# EAGLE design YUSynth-LFO-ioboard (EAGLE 9.6.2)
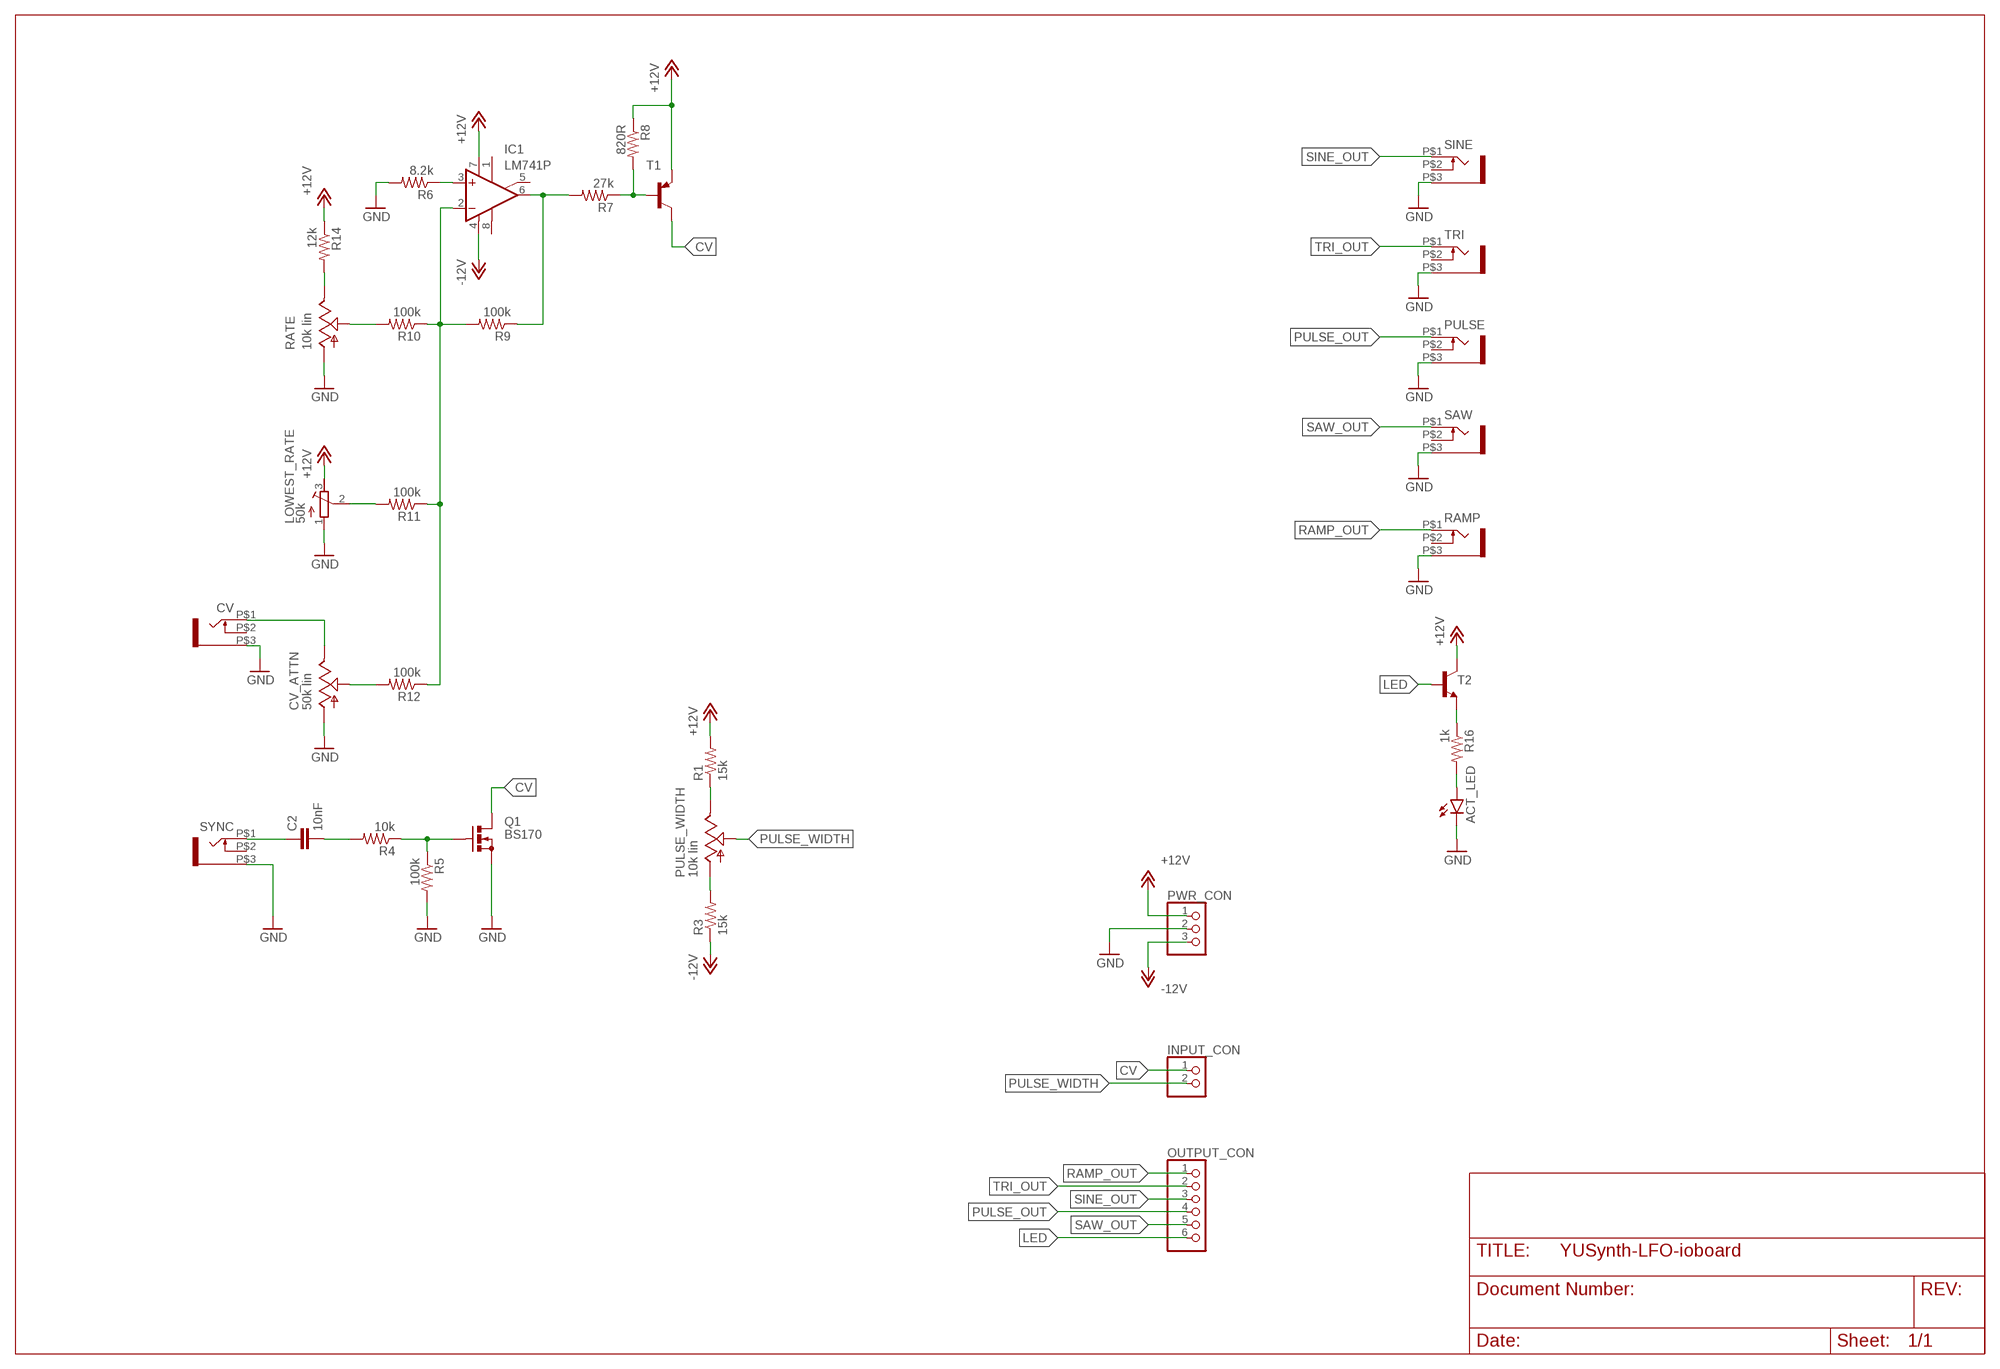
[diagram p0: schematic, sheet 1]

## Parts
ACT_LED  LED5MM  [LED5MM]
C2  10nF  C-EU050-024X044  [C050-024X044]
CV  WQP-PJ301M-12_JACK  [WQP-PJ301M-12_JACK]
CV_ATTN  50k lin  ALPHA-9MMA  [EVUF]
IC1  LM741P  [DIL08]
INPUT_CON  PINHD-1X2  [1X02]
LOWEST_RATE  50k  R-TRIMM64X  [RTRIM64X]
OUTPUT_CON  PINHD-1X6  [1X06]
PULSE  WQP-PJ301M-12_JACK  [WQP-PJ301M-12_JACK]
PULSE_WIDTH  10k lin  ALPHA-9MMA  [EVUF]
PWR_CON  PINHD-1X3  [1X03]
Q1  BS170  [SOT54E]
R1  15k  R-US_0207/7  [0207/7]
R3  15k  R-US_0207/7  [0207/7]
R4  10k  R-US_0207/7  [0207/7]
R5  100k  R-US_0207/7  [0207/7]
R6  8.2k  R-US_0207/7  [0207/7]
R7  27k  R-US_0207/7  [0207/7]
R8  820R  R-US_0207/7  [0207/7]
R9  100k  R-US_0207/7  [0207/7]
R10  100k  R-US_0207/7  [0207/7]
R11  100k  R-US_0207/7  [0207/7]
R12  100k  R-US_0207/7  [0207/7]
R14  12k  R-US_0207/7  [0207/7]
R16  1k  R-US_0207/7  [0207/7]
RAMP  WQP-PJ301M-12_JACK  [WQP-PJ301M-12_JACK]
RATE  10k lin  ALPHA-9MMA  [EVUF]
SAW  WQP-PJ301M-12_JACK  [WQP-PJ301M-12_JACK]
SINE  WQP-PJ301M-12_JACK  [WQP-PJ301M-12_JACK]
SYNC  WQP-PJ301M-12_JACK  [WQP-PJ301M-12_JACK]
T1  BC557C-PNP-TO92-EBC  [TO92-EBC]
T2  BC547-NPN-TO92-CBE  [TO92-CBE]
TRI  WQP-PJ301M-12_JACK  [WQP-PJ301M-12_JACK]

## Nets
+12V: IC1.7(V+) LOWEST_RATE.3(E) PWR_CON.1 R1.2 R8.1 R14.1 T1.E T2.C
-12V: IC1.4(V-) PWR_CON.3 R3.1
CV: INPUT_CON.1 Q1.D T1.C
GND: ACT_LED.K(C) CV.P$3 CV_ATTN.1(A) LOWEST_RATE.1(A) PULSE.P$3 PWR_CON.2 Q1.S R5.2 R6.2 RAMP.P$3 RATE.1(A) SAW.P$3 SINE.P$3 SYNC.P$3 TRI.P$3
LED: OUTPUT_CON.6 T2.B
N$1: PULSE_WIDTH.1(A) R3.2
N$2: PULSE_WIDTH.3(E) R1.1
N$3: C2.1 SYNC.P$1
N$4: C2.2 R4.2
N$5: Q1.G R4.1 R5.1
N$7: IC1.3(+IN) R6.1
N$8: IC1.6(OUT) R7.2 R9.1
N$9: R7.1 R8.2 T1.B
N$10: R14.2 RATE.3(E)
N$11: R10.2 RATE.2(S)
N$13: IC1.2(-IN) R9.2 R10.1 R11.1 R12.1
N$14: LOWEST_RATE.2(S) R11.2
N$15: CV_ATTN.2(S) R12.2
N$16: CV.P$1 CV_ATTN.3(E)
N$17: R16.1 T2.E
N$18: ACT_LED.A R16.2
PULSE_OUT: OUTPUT_CON.4 PULSE.P$1
PULSE_WIDTH: INPUT_CON.2 PULSE_WIDTH.2(S)
RAMP_OUT: OUTPUT_CON.1 RAMP.P$1
SAW_OUT: OUTPUT_CON.5 SAW.P$1
SINE_OUT: OUTPUT_CON.3 SINE.P$1
TRI_OUT: OUTPUT_CON.2 TRI.P$1
Unconnected: CV.P$2 IC1.1(ON1) IC1.5(ON2) IC1.8(OPT) PULSE.P$2 RAMP.P$2 SAW.P$2 SINE.P$2 SYNC.P$2 TRI.P$2

## Library data of the parts
ACT_LED = led:LED: LED OSRAM: - CHIPLED LG R971, LG N971, LY N971, LG Q971, LY Q971, LO R971, LY R971 LH N974, LH R974 LS Q976, LO Q976, LY Q976 LO Q996 - Hyper CHIPLED LW Q18S LB Q993, LB Q99A, LB R99A - SideLED LS A670, LO A670, LY A670, LG A670, LP A670 LB A673, LV A673, LT A673, LW A673 LH A674 LY A675 LS A676, LA A676, LO A676, LY A676, LW A676 LS A679, LY A679, LG A679 - Hyper Micro SIDELED® LS Y876, LA Y876, LO Y876, LY Y876 LT Y87S - SmartLED LW L88C, LW L88S LB L89C, LB L89S, LG L890 LS L89K, LO L89K, LY L89K LS L896, LA L896, LO L896, LY L896 - TOPLED LS T670, LO T670, LY T670, LG T670, LP T670 LSG T670, LSP T670, LSY T670, LOP T670, LYG T670 LG T671, LOG T671, LSG T671 LB T673, LV T673, LT T673, LW T673 LH T674 LS T676, LA T676, LO T676, LY T676, LB T676, LH T676, LSB T676, LW T676 LB T67C, LV T67C, LT T67C, LS T67K, LO T67K, LY T67K, LW E67C LS E67B, LA E67B, LO E67B, LY E67B, LB E67C, LV E67C, LT E67C LW T67C LS T679, LY T679, LG T679 LS T770, LO T770, LY T770, LG T770, LP T770 LB T773, LV T773, LT T773, LW T773 LH T774 LS E675, LA E675, LY E675, LS T675 LS T776, LA T776, LO T776, LY T776, LB T776 LHGB T686 LT T68C, LB T68C - Hyper Mini TOPLED® LB M676 - Mini TOPLED Santana® LG M470 LS M47K, LO M47K, LY M47K Source: http://www.osram.convergy.de LUXEON: - LUMILED® LXK2-PW12-R00, LXK2-PW12-S00, LXK2-PW14-U00, LXK2-PW14-V00 LXK2-PM12-R00, LXK2-PM12-S00, LXK2-PM14-U00 LXK2-PE12-Q00, LXK2-PE12-R00, LXK2-PE12-S00, LXK2-PE14-T00, LXK2-PE14-U00 LXK2-PB12-K00, LXK2-PB12-L00, LXK2-PB12-M00, LXK2-PB14-N00, LXK2-PB14-P00, LXK2-PB14-Q00 LXK2-PR12-L00, LXK2-PR12-M00, LXK2-PR14-Q00, LXK2-PR14-R00 LXK2-PD12-Q00, LXK2-PD12-R00, LXK2-PD12-S00 LXK2-PH12-R00, LXK2-PH12-S00 LXK2-PL12-P00, LXK2-PL12-Q00, LXK2-PL12-R00 Source: www.luxeon.com KINGBRIGHT: KA-3528ASYC Source: www.kingbright.com
C2 = rcl:C-EU: CAPACITOR, European symbol; SPICEPREFIX: C
CV PULSE RAMP SAW SINE SYNC TRI = thonkiconn:WQP-PJ301M-12_JACK
CV_ATTN PULSE_WIDTH RATE = TomW:ALPHA-9MM: 9 mm Square Rotary Potentiometers Source: Panasonic
IC1 = linear:*741: OP AMP
INPUT_CON = pinhead:PINHD-1X2: PIN HEADER
LOWEST_RATE = rcl:R-TRIMM: Trimm resistor; SPICEMODEL: X; SPICEPREFIXL: POT
OUTPUT_CON = pinhead:PINHD-1X6: PIN HEADER
PWR_CON = pinhead:PINHD-1X3: PIN HEADER
Q1 = transistor-small-signal:BS170: N-CHANNEL MOS FET
R1 R3-R12 R14 R16 = rcl:R-US_: RESISTOR, American symbol; SPICEPREFIX: R
T1 = transistor:*-PNP-: PNP Transistror
T2 = transistor:*-NPN-: NPN Transistror BF959 corrected 2008.03.06

## Board
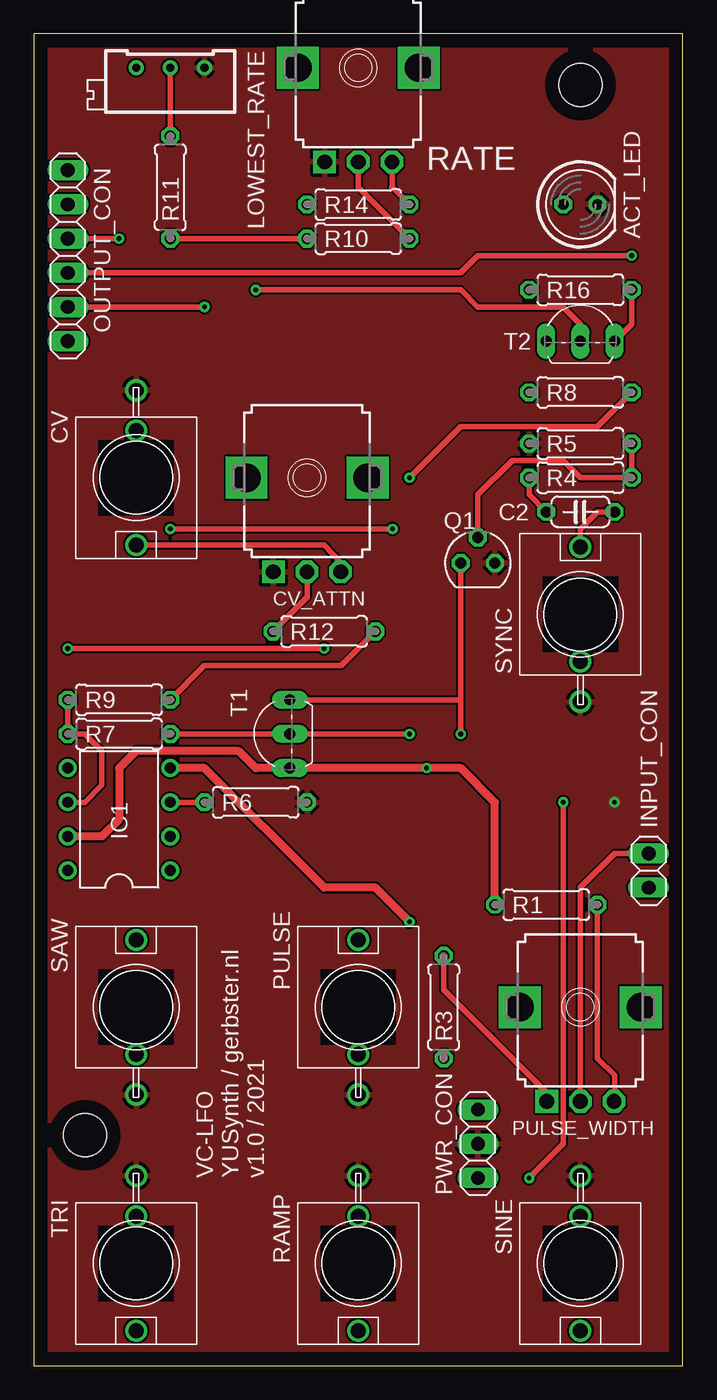
[diagram p1: board, top side]
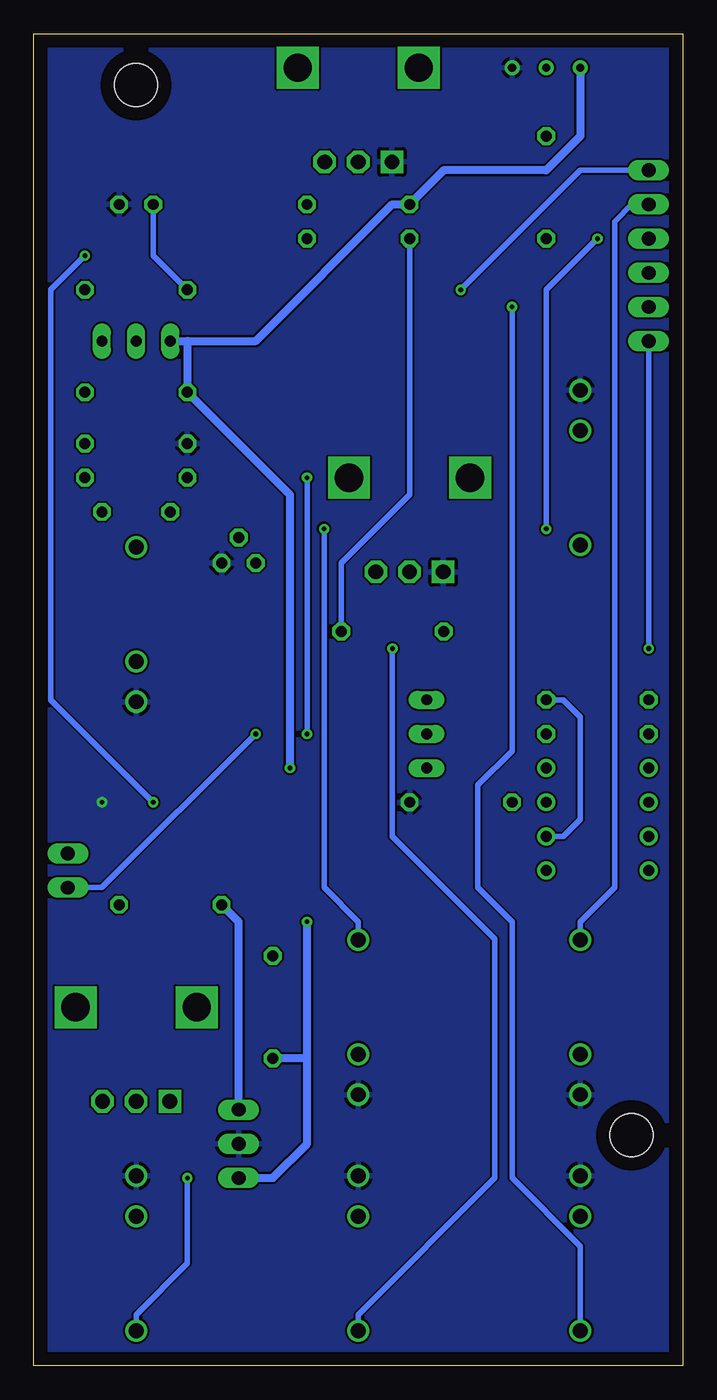
[diagram p2: board, bottom side, seen from below]

Size 48.26 x 99.06 mm. Coordinates in mm from the lower left corner, seen from the top.
Outline: 0,0 48.26,0 48.26,99.06 0,99.06 0,0
Copper layers (1*16): Top 0.035mm / dielectric 1.5mm / Bottom 0.035mm
Design rules "default": minimum track width 6mil, minimum drill 0.35mm, track to track 6mil, track to pad 6mil, pad to pad 6mil, via to via 6mil, smd to smd 6mil, copper to edge 40mil, drill to drill 6mil, minimum pad ring 10mil, minimum via ring 8mil, stop-mask expansion 4mil, vias tented up to drill 0mil, thermal gap 10mil
Holes 3.2 mm at 3.81,17.14 40.64,95.25

### Footprints (pad centres in the part's own frame; a part is rotated, then mirrored left to right if it is on the bottom)
LED5MM = drill 0.813 octagon: A -1.27,0; K 1.27,0
C050-024X044 = drill 0.813 octagon: 1 -2.54,0; 2 2.54,0
WQP-PJ301M-12_JACK = drill 1.1: P$1 0,5; P$2 0,-3.5; P$3 0,-6.5
EVUF = drill 1.1 pad 1.676 square: 1 -2.5,-7 | drill 1.1 pad 1.676 octagon: 2 0,-7; 3 2.5,-7 | drill 2.1 pad 2.8 square: M1 4.5,0; M2 -4.5,0
DIL08 = drill 0.813 pad 1.27: 1 -3.81,-3.81; 2 -1.27,-3.81; 3 1.27,-3.81; 4 3.81,-3.81; 5 3.81,3.81; 6 1.27,3.81; 7 -1.27,3.81; 8 -3.81,3.81
1X02 = drill 1.016 long: 1 -1.27,0; 2 1.27,0
RTRIM64X = drill 0.61: 1 1.27,-2.54; 2 1.27,0; 3 1.27,2.54
1X06 = drill 1.016 long: 1 -6.35,0; 2 -3.81,0; 3 -1.27,0; 4 1.27,0; 5 3.81,0; 6 6.35,0
1X03 = drill 1.016 long: 1 -2.54,0; 2 0,0; 3 2.54,0
SOT54E = drill 0.813 octagon: D -1.27,0; G 0,1.905; S 1.27,0
0207/7 = drill 0.813 octagon: 1 -3.81,0; 2 3.81,0
TO92-EBC = drill 0.813 long: B 0,-1.27; C 2.54,-1.27; E -2.54,-1.27
TO92-CBE = drill 0.813 long: B 0,0; C -2.54,0; E 2.54,0

### Placement (x,y rotation side)
ACT_LED  40.64,86.36 0 top
C2  40.64,63.5 180 top
CV  7.62,66.04 180 top
CV_ATTN  20.32,66.04 0 top
IC1  6.35,40.64 90 top
INPUT_CON  45.72,36.83 90 top
LOWEST_RATE  10.16,95.25 90 top
OUTPUT_CON  2.54,82.55 90 top
PULSE  24.13,26.67 0 top
PULSE_WIDTH  40.64,26.67 0 top
PWR_CON  33.02,16.51 270 top
Q1  33.02,59.69 0 top
R1  38.1,34.29 180 top
R3  30.48,26.67 90 top
R4  40.64,66.04 180 top
R5  40.64,68.58 180 top
R6  16.51,41.91 0 top
R7  6.35,46.99 180 top
R8  40.64,72.39 0 top
R9  6.35,49.53 0 top
R10  24.13,83.82 0 top
R11  10.16,87.63 90 top
R12  21.59,54.61 180 top
R14  24.13,86.36 0 top
R16  40.64,80.01 180 top
RAMP  24.13,7.62 180 top
RATE  24.13,96.52 0 top
SAW  7.62,26.67 0 top
SINE  40.64,7.62 180 top
SYNC  40.64,55.88 0 top
T1  17.78,46.99 90 top
T2  40.64,76.2 0 top
TRI  7.62,7.62 180 top

### Tracks (layer width: path | path; a pad name or v marks a point on that pad's centre or on a via)
+12V  (via drill 0.35)
  Top 0.61: IC1.7 5.08,39.37 6.35,40.64 6.35,44.45 7.62,45.72 15.24,45.72 16.51,44.45 T1.E v29.21,44.45 31.75,44.45 34.29,41.91 R1.2
  Bottom 0.61: LOWEST_RATE.3 7.62,91.44 10.16,88.9 17.78,88.9 R14.1 21.59,86.36 31.75,76.2 T2.C 36.83,76.2 R8.1 29.21,64.77 v29.21,44.45 | PWR_CON.1 33.02,33.02 R1.2
-12V  (via drill 0.35)
  Top 0.61: v27.94,33.02 25.4,35.56 21.59,35.56 12.7,44.45 IC1.4
  Bottom 0.61: PWR_CON.3 30.48,13.97 27.94,16.51 27.94,22.86 | 27.94,22.86 R3.1 | 27.94,22.86 v27.94,33.02
CV  (via drill 0.35)
  Top 0.406: Q1.D 31.75,49.53 | 31.75,49.53 v31.75,46.99 | T1.C 31.75,49.53
  Bottom 0.406: v31.75,46.99 43.18,35.56 INPUT_CON.1
GND  (via drill 0.35)
  other vias: 43.18,41.91
  pour Top: 0,99.06 0,0 48.26,0 48.26,99.06
  pour Bottom: 0,99.06 0,0 48.26,0 48.26,99.06
LED  (via drill 0.35)
  Top 0.406: v16.51,80.01 31.75,80.01 33.02,78.74 39.37,78.74 40.64,77.47 T2.B
  Bottom 0.406: OUTPUT_CON.6 7.62,88.9 v16.51,80.01
N$1
  Top 0.406: PULSE_WIDTH.1 38.1,19.67 38.1,20.32 30.48,27.94 R3.2
N$2
  Top 0.406: R1.1 41.91,22.86 43.18,21.59 43.18,19.67 PULSE_WIDTH.3
N$3
  Top 0.406: C2.1 41.91,63.5 40.64,62.23 SYNC.P$1
N$4
  Top 0.406: R4.2 36.83,64.77 C2.2
N$5
  Top 0.406: R5.1 R4.1 40.64,66.04 39.37,67.31 35.56,67.31 33.02,64.77 Q1.G
N$7
  Top 0.406: IC1.3 R6.1
N$8
  Top 0.406: IC1.6 3.81,41.91 5.08,43.18 5.08,45.72 3.81,46.99 R7.2 R9.1
N$9  (via drill 0.35)
  Top 0.406: R7.1 T1.B v27.94,46.99 | v27.94,66.04 31.75,69.85 41.91,69.85 R8.2
  Bottom 0.406: v27.94,46.99 v27.94,66.04
N$10
  Top 0.406: RATE.3 26.67,87.63 | 26.63,87.63 26.67,87.63 | 26.67,87.63 R14.2
N$11
  Top 0.406: RATE.2 24.13,87.63 R10.2
N$13
  Top 0.406: R11.1 R10.1 | R9.2 12.7,52.07 22.86,52.07 R12.1
  Bottom 0.406: R9.2 8.89,49.53 7.62,48.26 7.62,40.64 8.89,39.37 IC1.2 | R12.1 25.4,59.69 20.32,64.77 R10.1
N$14
  Top 0.406: R11.2 LOWEST_RATE.2
N$15
  Top 0.406: CV_ATTN.2 20.32,57.15 R12.2
N$16
  Top 0.406: CV.P$1 21.59,61.04 22.86,59.69 22.86,59.04 CV_ATTN.3
N$17
  Top 0.406: R16.1 44.45,77.47 T2.E
N$18
  Bottom 0.406: R16.2 39.37,82.55 ACT_LED.A
PULSE_OUT  (via drill 0.35)
  Top 0.406: v26.67,62.23 v10.16,62.23 | v6.35,83.82 OUTPUT_CON.4
  Bottom 0.406: PULSE.P$1 24.13,33.02 26.67,35.56 v26.67,62.23 | v10.16,62.23 10.16,80.01 v6.35,83.82
PULSE_WIDTH
  Top 0.406: PULSE_WIDTH.2 40.64,35.56 43.18,38.1 INPUT_CON.2
RAMP_OUT  (via drill 0.35)
  Top 0.406: v2.54,53.34 v21.59,53.34
  Bottom 0.406: OUTPUT_CON.1 v2.54,53.34 | RAMP.P$1 24.13,3.81 13.97,13.97 13.97,31.75 21.59,39.37 v21.59,53.34
SAW_OUT
  Bottom 0.406: SAW.P$1 7.62,33.02 5.08,35.56 5.08,85.09 3.81,86.36 OUTPUT_CON.5
SINE_OUT  (via drill 0.35)
  Top 0.406: OUTPUT_CON.3 31.75,81.28 33.02,82.55 v44.45,82.55 | v36.83,13.97 39.37,16.51 v39.37,41.91
  Bottom 0.406: v44.45,82.55 46.99,80.01 46.99,49.53 v39.37,41.91 | SINE.P$1 40.64,3.81 36.83,7.62 v36.83,13.97
TRI_OUT  (via drill 0.35)
  Top 0.406: v12.7,78.74 OUTPUT_CON.2
  Bottom 0.406: TRI.P$1 7.62,8.89 12.7,13.97 12.7,33.02 15.24,35.56 15.24,43.18 12.7,45.72 v12.7,78.74

### Text on the board
tNames: VC-LFO / YUSynth / gerbster.nl / v1.0 / 2021